# EAGLE schematic usb_to_uart (EAGLE 6.4)
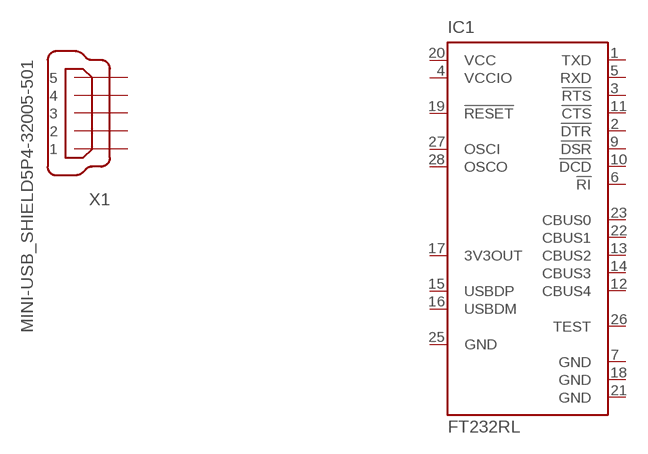
[diagram p0: schematic, sheet 1]

## Parts
IC1  FT232RL  [SSOP28]
X1  MINI-USB_SHIELD5P4-32005-501  [32005-501]
Unconnected: IC1.1(TXD) IC1.2(!DTR) IC1.3(!RTS) IC1.5(RXD) IC1.6(!RI) IC1.9(!DSR) IC1.10(!DCD) IC1.11(!CTS) IC1.12(CBUS4) IC1.13(CBUS2) IC1.14(CBUS3) IC1.15(USBDP) IC1.16(USBDM) IC1.17(3V3OUT) IC1.19(!RESET) IC1.22(CBUS1) IC1.23(CBUS0) IC1.26(TEST) IC1.27(OSCI) IC1.28(OSCO) X1.1 X1.2 X1.3 X1.4 X1.5 X1.M1(S1) X1.M2(S2) X1.M3(S3) X1.M4(S4)

## Power pins joined to a net without a drawn wire
GND: IC1.7(GND) IC1.18(GND) IC1.21(GND) IC1.25(GND)
VCC: IC1.20(VCC)
VCCIO: IC1.4(VCCIO)

## Library data of the parts
IC1 = ftdichip:FT232R: Source: http://www.ftdichip.com/Documents/DataSheets/DS_FT232R_v104.pdf; MPN: FT232RL; OC_FARNELL: 1146032; OC_NEWARK: 91K9918
X1 = con-cypressindustries:MINI-USB_SHIELD5P4-: MINI USB-B R/A W/O POST 5 pol. Source: www.cypressindustries.com; OC_FARNELL: unknown; OC_NEWARK: unknown